# Altium schematic sheet RK-PERIPHERAL-POWER.SchDoc
size 594 x 420 mm; SheetNumber: 17; SheetTotal: 32
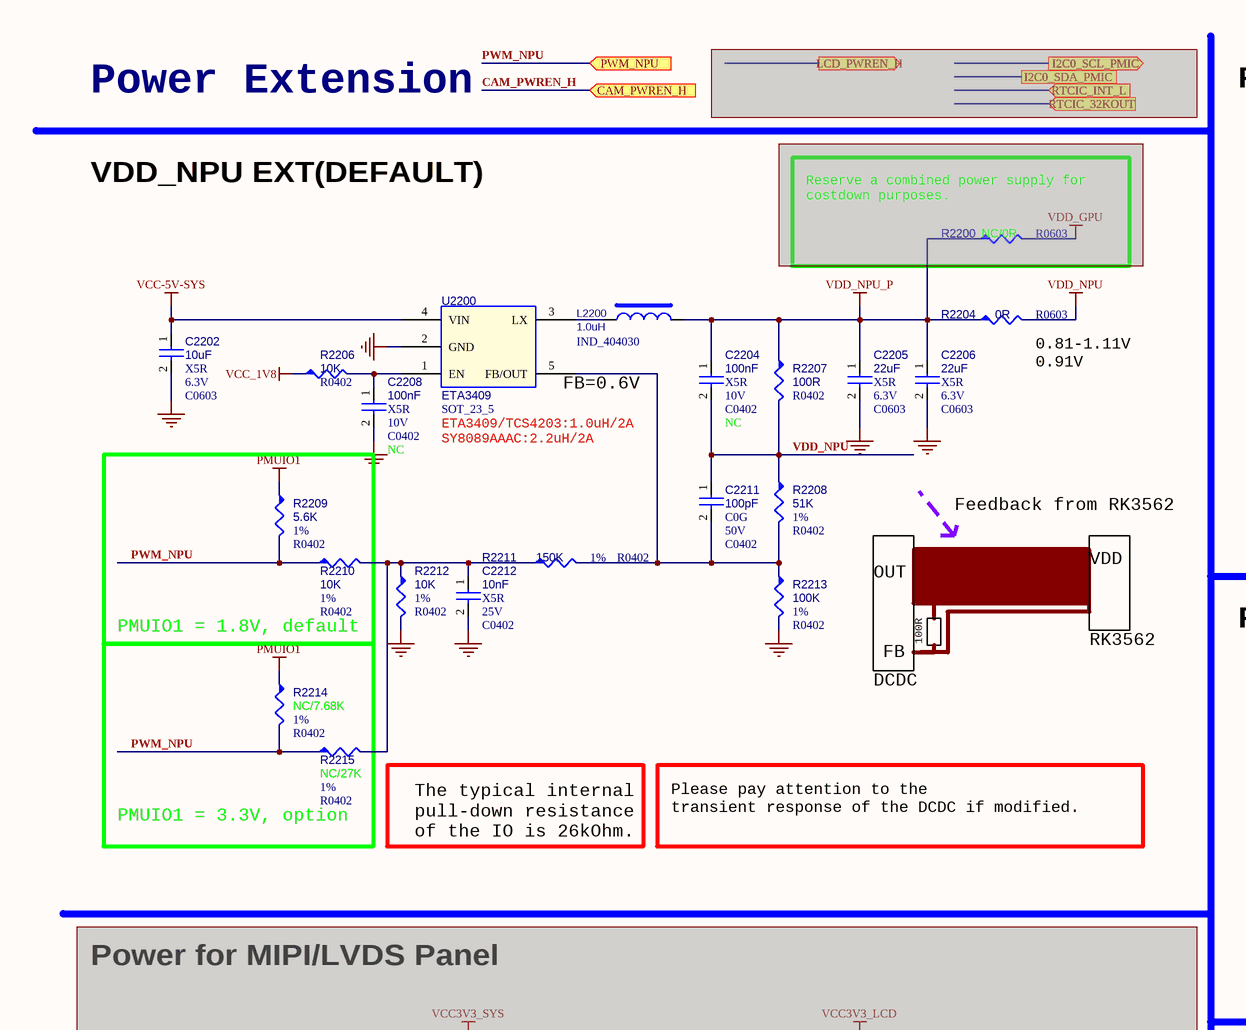
[diagram p0: RK-PERIPHERAL-POWER.SchDoc, top left]
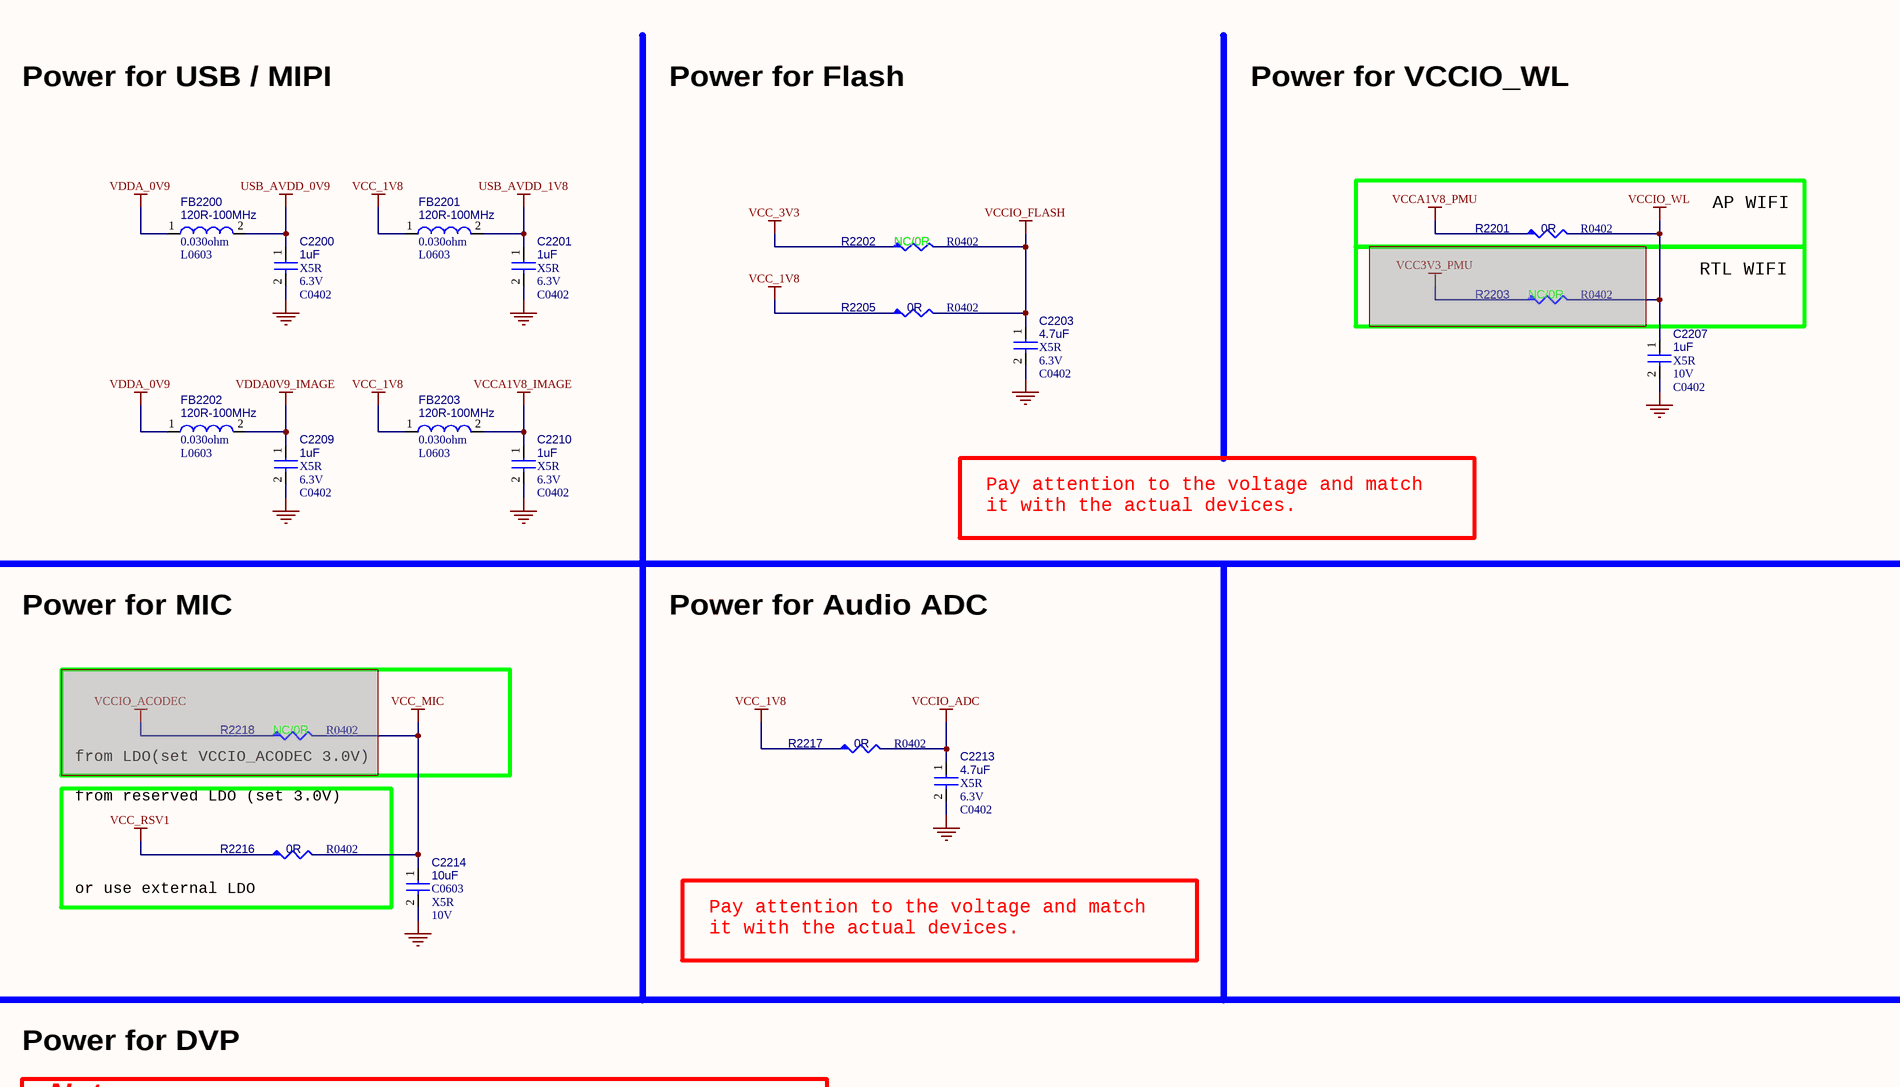
[diagram p1: RK-PERIPHERAL-POWER.SchDoc, top right]
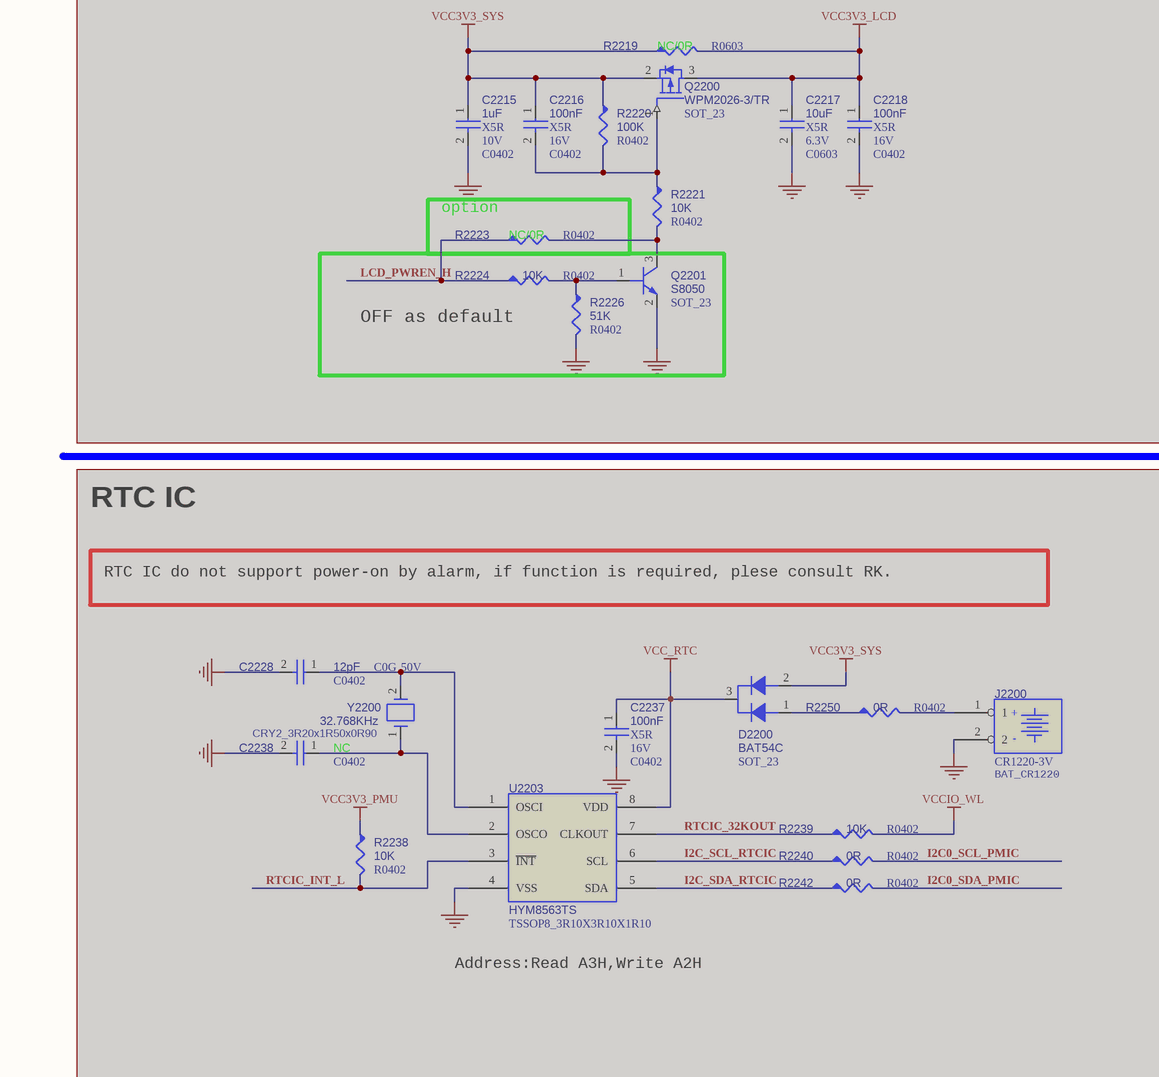
[diagram p2: RK-PERIPHERAL-POWER.SchDoc, bottom left]
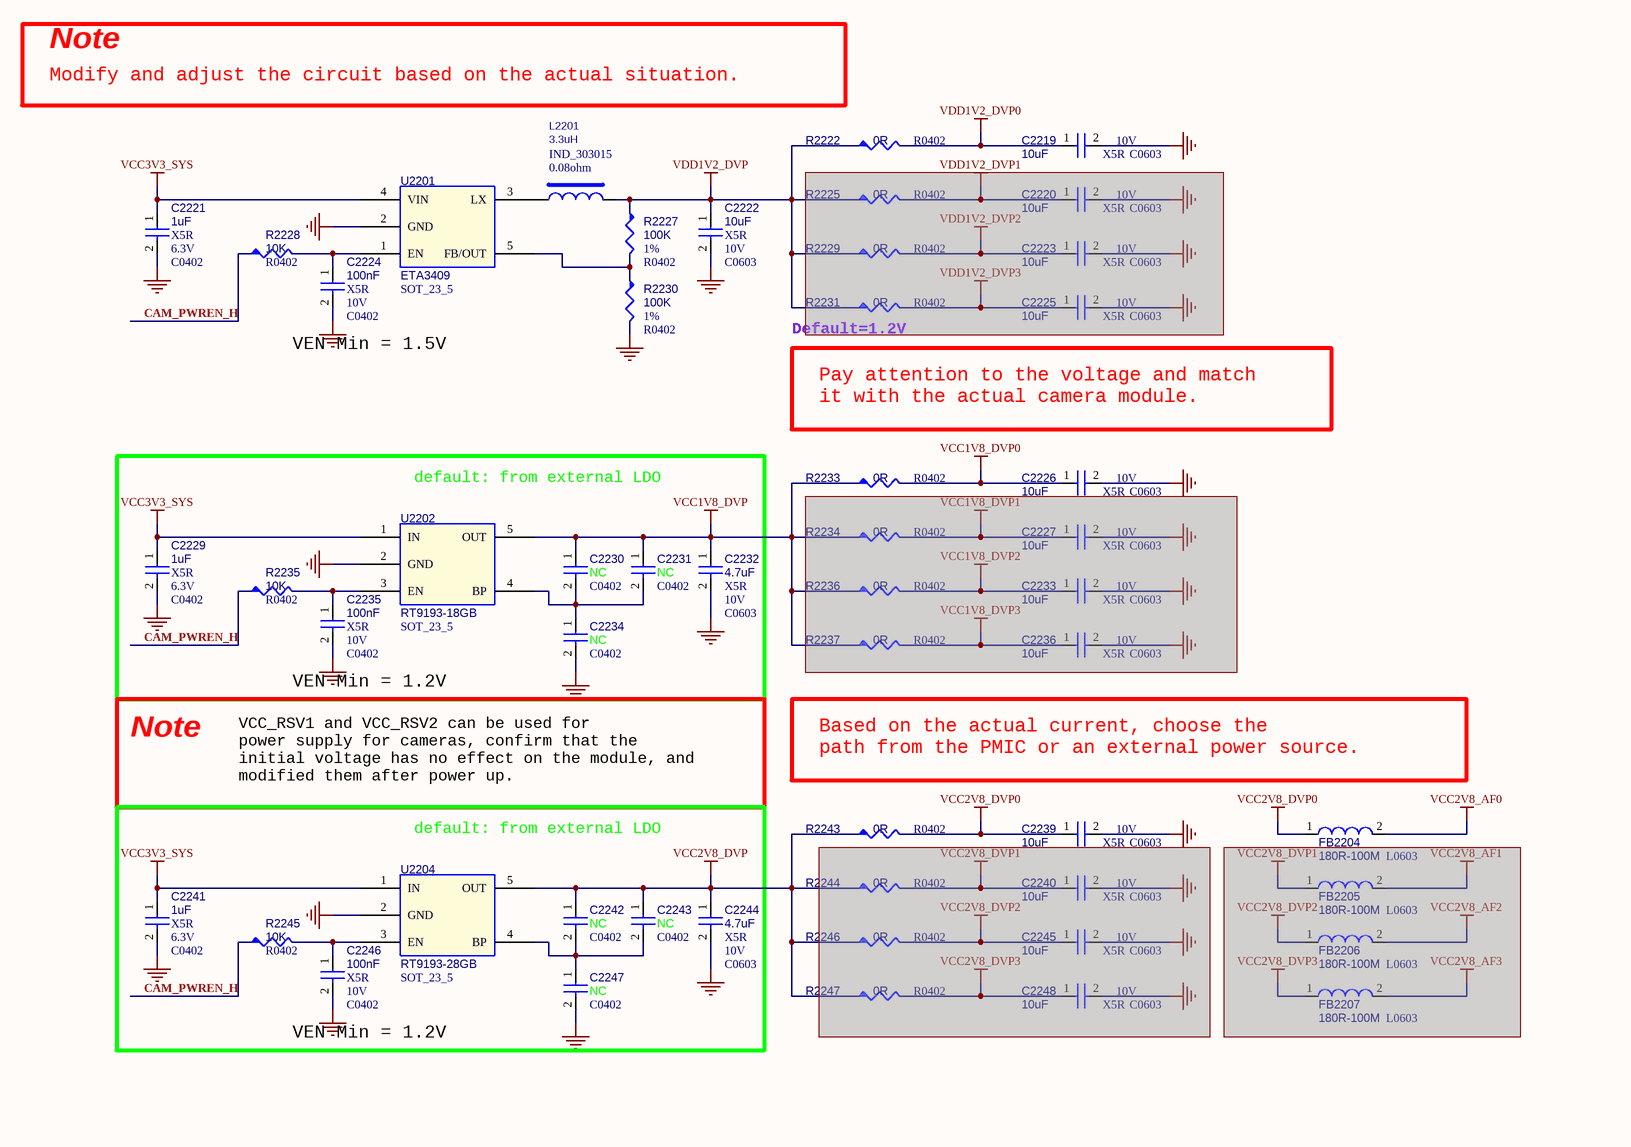
[diagram p3: RK-PERIPHERAL-POWER.SchDoc, bottom right]

## Parts
C2200  1uF  Dielectric: X5R  Voltage: 6.3V  [C0402]
C2201  1uF  Dielectric: X5R  Voltage: 6.3V  [C0402]
C2202  10uF  Dielectric: X5R  Voltage: 6.3V  [C0603]
C2203  4.7uF  Dielectric: X5R  Voltage: 6.3V  [C0402]
C2204  100nF  Dielectric: X5R  Voltage: 10V  option: NC  [C0402]
C2205  22uF  Dielectric: X5R  Voltage: 6.3V  [C0603]
C2206  22uF  Dielectric: X5R  Voltage: 6.3V  [C0603]
C2207  1uF  Dielectric: X5R  Voltage: 10V  [C0402]
C2208  100nF  Dielectric: X5R  Voltage: 10V  option: NC  [C0402]
C2209  1uF  Dielectric: X5R  Voltage: 6.3V  [C0402]
C2210  1uF  Dielectric: X5R  Voltage: 6.3V  [C0402]
C2211  100pF  Dielectric: C0G  Voltage: 50V  [C0402]
C2212  10nF  Dielectric: X5R  Voltage: 25V  [C0402]
C2213  4.7uF  Dielectric: X5R  Voltage: 6.3V  [C0402]
C2214  10uF  Dielectric: X5R  Voltage: 10V  [C0603]
C2215  1uF  Dielectric: X5R  Voltage: 10V  [C0402]  (masked out: inside a compile mask, not in the netlist)
C2216  100nF  Dielectric: X5R  Voltage: 16V  [C0402]  (masked out: inside a compile mask, not in the netlist)
C2217  10uF  Dielectric: X5R  Voltage: 6.3V  [C0603]  (masked out: inside a compile mask, not in the netlist)
C2218  100nF  Dielectric: X5R  Voltage: 16V  [C0402]  (masked out: inside a compile mask, not in the netlist)
C2219  10uF  Dielectric: X5R  Voltage: 10V  [C0603]
C2220  10uF  Dielectric: X5R  Voltage: 10V  [C0603]  (masked out: inside a compile mask, not in the netlist)
C2221  1uF  Dielectric: X5R  Voltage: 6.3V  [C0402]
C2222  10uF  Dielectric: X5R  Voltage: 10V  [C0603]
C2223  10uF  Dielectric: X5R  Voltage: 10V  [C0603]  (masked out: inside a compile mask, not in the netlist)
C2224  100nF  Dielectric: X5R  Voltage: 10V  [C0402]
C2225  10uF  Dielectric: X5R  Voltage: 10V  [C0603]  (masked out: inside a compile mask, not in the netlist)
C2226  10uF  Dielectric: X5R  Voltage: 10V  [C0603]
C2227  10uF  Dielectric: X5R  Voltage: 10V  [C0603]  (masked out: inside a compile mask, not in the netlist)
C2228  12pF  Dielectric: C0G  Voltage: 50V  [C0402]  (masked out: inside a compile mask, not in the netlist)
C2229  1uF  Dielectric: X5R  Voltage: 6.3V  [C0402]
C2230  NC  [C0402]
C2231  NC  [C0402]
C2232  4.7uF  Dielectric: X5R  Voltage: 10V  [C0603]
C2233  10uF  Dielectric: X5R  Voltage: 10V  [C0603]  (masked out: inside a compile mask, not in the netlist)
C2234  NC  [C0402]
C2235  100nF  Dielectric: X5R  Voltage: 10V  [C0402]
C2236  10uF  Dielectric: X5R  Voltage: 10V  [C0603]  (masked out: inside a compile mask, not in the netlist)
C2237  100nF  Dielectric: X5R  Voltage: 16V  [C0402]  (masked out: inside a compile mask, not in the netlist)
C2238  NC  [C0402]  (masked out: inside a compile mask, not in the netlist)
C2239  10uF  Dielectric: X5R  Voltage: 10V  [C0603]
C2240  10uF  Dielectric: X5R  Voltage: 10V  [C0603]  (masked out: inside a compile mask, not in the netlist)
C2241  1uF  Dielectric: X5R  Voltage: 6.3V  [C0402]
C2242  NC  [C0402]
C2243  NC  [C0402]
C2244  4.7uF  Dielectric: X5R  Voltage: 10V  [C0603]
C2245  10uF  Dielectric: X5R  Voltage: 10V  [C0603]  (masked out: inside a compile mask, not in the netlist)
C2246  100nF  Dielectric: X5R  Voltage: 10V  [C0402]
C2247  NC  [C0402]
C2248  10uF  Dielectric: X5R  Voltage: 10V  [C0603]  (masked out: inside a compile mask, not in the netlist)
D2200  BAT54C  [SOT_23]  (masked out: inside a compile mask, not in the netlist)
FB2200  120R-100MHz  DC Resistor: 0.030ohm  [L0603]
FB2201  120R-100MHz  DC Resistor: 0.030ohm  [L0603]
FB2202  120R-100MHz  DC Resistor: 0.030ohm  [L0603]
FB2203  120R-100MHz  DC Resistor: 0.030ohm  [L0603]
FB2204  180R-100M  [L0603]
FB2205  180R-100M  [L0603]  (masked out: inside a compile mask, not in the netlist)
FB2206  180R-100M  [L0603]  (masked out: inside a compile mask, not in the netlist)
FB2207  180R-100M  [L0603]  (masked out: inside a compile mask, not in the netlist)
J2200  CR1220-3V  PCB Footprint: BAT_CR1220  [BATTERY-20MM]  (masked out: inside a compile mask, not in the netlist)
L2200  1.0uH  [IND_404030]
L2201  3.3uH  DC Resistor: 0.08ohm  [IND_303015]
Q2200  WPM2026-3/TR  PCB Footprint: SOT_23  [SOT23]  (masked out: inside a compile mask, not in the netlist)
Q2201  S8050  [SOT_23]  (masked out: inside a compile mask, not in the netlist)
R2200  NC/0R  PCB Footprint: R0603  [R0402]  (masked out: inside a compile mask, not in the netlist)
R2201  0R  [R0402]
R2202  NC/0R  [R0402]
R2203  NC/0R  [R0402]  (masked out: inside a compile mask, not in the netlist)
R2204  0R  PCB Footprint: R0603  [R0402]
R2205  0R  [R0402]
R2206  10K  [R0402]
R2207  100R  [R0402]
R2208  51K  Tolerance: 1%  [R0402]
R2209  5.6K  Tolerance: 1%  [R0402]
R2210  10K  Tolerance: 1%  [R0402]
R2211  150K  Tolerance: 1%  [R0402]
R2212  10K  Tolerance: 1%  [R0402]
R2213  100K  Tolerance: 1%  [R0402]
R2214  NC/7.68K  Tolerance: 1%  [R0402]
R2215  NC/27K  Tolerance: 1%  [R0402]
R2216  0R  [R0402]
R2217  0R  [R0402]
R2218  NC/0R  [R0402]  (masked out: inside a compile mask, not in the netlist)
R2219  NC/0R  PCB Footprint: R0603  [R0402]  (masked out: inside a compile mask, not in the netlist)
R2220  100K  [R0402]  (masked out: inside a compile mask, not in the netlist)
R2221  10K  [R0402]  (masked out: inside a compile mask, not in the netlist)
R2222  0R  [R0402]
R2223  NC/0R  [R0402]  (masked out: inside a compile mask, not in the netlist)
R2224  10K  [R0402]  (masked out: inside a compile mask, not in the netlist)
R2225  0R  [R0402]  (masked out: inside a compile mask, not in the netlist)
R2226  51K  [R0402]  (masked out: inside a compile mask, not in the netlist)
R2227  100K  Tolerance: 1%  [R0402]
R2228  10K  [R0402]
R2229  0R  [R0402]  (masked out: inside a compile mask, not in the netlist)
R2230  100K  Tolerance: 1%  [R0402]
R2231  0R  [R0402]  (masked out: inside a compile mask, not in the netlist)
R2233  0R  [R0402]
R2234  0R  [R0402]  (masked out: inside a compile mask, not in the netlist)
R2235  10K  [R0402]
R2236  0R  [R0402]  (masked out: inside a compile mask, not in the netlist)
R2237  0R  [R0402]  (masked out: inside a compile mask, not in the netlist)
R2238  10K  [R0402]  (masked out: inside a compile mask, not in the netlist)
R2239  10K  [R0402]  (masked out: inside a compile mask, not in the netlist)
R2240  0R  [R0402]  (masked out: inside a compile mask, not in the netlist)
R2242  0R  [R0402]  (masked out: inside a compile mask, not in the netlist)
R2243  0R  [R0402]
R2244  0R  [R0402]  (masked out: inside a compile mask, not in the netlist)
R2245  10K  [R0402]
R2246  0R  [R0402]  (masked out: inside a compile mask, not in the netlist)
R2247  0R  [R0402]  (masked out: inside a compile mask, not in the netlist)
R2250  0R  [R0402]  (masked out: inside a compile mask, not in the netlist)
U2200  ETA3409  [SOT_23_5]
U2201  ETA3409  [SOT_23_5]
U2202  RT9193-18GB  [SOT_23_5]
U2203  HYM8563TS  [TSSOP8_3R10X3R10X1R10]  (masked out: inside a compile mask, not in the netlist)
U2204  RT9193-28GB  [SOT_23_5]
Y2200  32.768KHz  [CRY2_3R20x1R50x0R90]  (masked out: inside a compile mask, not in the netlist)

## Blocks framed on the sheet
AP WIFI: R2201
RTL WIFI: R2203
PMUIO1 = 1.8V, default: R2209 R2210
PMUIO1 = 3.3V, option: R2214 R2215
from LDO(set VCCIO_ACODEC 3.0V): R2218
option: R2223
OFF as default: Q2201 R2224 R2226
VEN Min = 1.2V: C2229-C2232 C2234 C2235 R2235 U2202
VEN Min = 1.2V: C2241-C2244 C2246 C2247 R2245 U2204

## Ports
CAM_PWREN_H (in, see CONTROLLER-RK3562[2D]), I2C0_SCL_PMIC (out), I2C0_SDA_PMIC, LCD_PWREN_H (out), PWM_NPU (in, see CONTROLLER-RK3562[2D], RK3562-PMUIO-OSC-PLL[5C]), RTCIC_32KOUT (in), RTCIC_INT_L (in)

## Nets
GND: C2200.2 C2201.2 C2202.2 C2203.2 C2205.2 C2206.2 C2207.2 C2208.2 C2209.2 C2210.2 C2212.2 C2213.2 C2214.2 C2219.2 C2221.2 C2222.2 C2224.2 C2226.2 C2229.2 C2232.2 C2234.2 C2235.2 C2239.2 C2241.2 C2244.2 C2246.2 C2247.2 R2212.2 R2213.2 R2230.2 U2200.2(GND) U2201.2(GND) U2202.2(GND) U2204.2(GND)
PMUIO1: R2209.1 R2214.1
USB_AVDD_0V9: C2200.1 FB2200.2
USB_AVDD_1V8: C2201.1 FB2201.2
VCC1V8_DVP: C2230.1 C2231.1 C2232.1 R2233.1 U2202.5(OUT)
VCC1V8_DVP0: C2226.1 R2233.2
VCC2V8_AF0: FB2204.2
VCC2V8_DVP: C2242.1 C2243.1 C2244.1 R2243.1 U2204.5(OUT)
VCC2V8_DVP0: C2239.1 FB2204.1 R2243.2
VCC3V3_SYS: C2221.1 C2229.1 C2241.1 U2201.4(VIN) U2202.1(IN) U2204.1(IN)
VCC-5V-SYS: C2202.1 U2200.4(VIN)
VCC_1V8: FB2201.1 FB2203.1 R2205.1 R2206.1 R2217.1
VCC_3V3: R2202.1
VCC_MIC: C2214.1 R2216.2
VCC_RSV1: R2216.1
VCCA1V8_IMAGE: C2210.1 FB2203.2
VCCA1V8_PMU: R2201.1
VCCIO_ADC: C2213.1 R2217.2
VCCIO_FLASH: C2203.1 R2202.2 R2205.2
VCCIO_WL: C2207.1 R2201.2
VDD1V2_DVP: C2222.1 L2201.2 R2222.1 R2227.1
VDD1V2_DVP0: C2219.1 R2222.2
VDD_NPU: C2204.2 C2211.1 R2204.2 R2207.2 R2208.1
VDD_NPU_P: C2204.1 C2205.1 C2206.1 L2200.2 R2204.1 R2207.1
VDDA0V9_IMAGE: C2209.1 FB2202.2
VDDA_0V9: FB2200.1 FB2202.1
CAM_PWREN_H: R2228.1 R2235.1 R2245.1 ; port CAM_PWREN_H
PWM_NPU: R2209.2 R2210.1 R2214.2 R2215.1 ; port PWM_NPU
NetC2208_1: C2208.1 R2206.2 U2200.1(EN)
NetC2211_2: C2211.2 R2208.2 R2211.2 R2213.1 U2200.5(FB/OUT)
NetC2212_1: C2212.1 R2210.2 R2211.1 R2212.1 R2215.2
NetC2224_1: C2224.1 R2228.2 U2201.1(EN)
NetC2230_2: C2230.2 C2231.2 C2234.1 U2202.4(BP)
NetC2235_1: C2235.1 R2235.2 U2202.3(EN)
NetC2242_2: C2242.2 C2243.2 C2247.1 U2204.4(BP)
NetC2246_1: C2246.1 R2245.2 U2204.3(EN)
NetL2200_1: L2200.1 U2200.3(LX)
NetL2201_1: L2201.1 U2201.3(LX)
NetR2227_2: R2227.2 R2230.1 U2201.5(FB/OUT)

## Notes on the sheet
- Power Extension
- Power for USB / MIPI
- Power for Flash
- Power for VCCIO_WL
- VDD_NPU EXT(DEFAULT)
- (near R2200) Reserve a combined power supply for
  costdown purposes.
- (near U2200) FB=0.6V
- (near R2204) 0.81-1.11V
  0.91V
- (near U2200) ETA3409/TCS4203:1.0uH/2A
  SY8089AAAC:2.2uH/2A
- Feedback from RK3562
- Pay attention to the voltage and match
  it with the actual devices.
- OUT
- VDD
- FB
- 100R
- RK3562
- Power for MIC
- Power for Audio ADC
- DCDC
- The typical internal
  pull-down resistance
  of the IO is 26kOhm.
- Please pay attention to the
  transient response of the DCDC if modified.
- from reserved LDO (set 3.0V)
- or use external LDO
- Power for MIPI/LVDS Panel
- Power for DVP
- Note
- Modify and adjust the circuit based on the actual situation.
- (near C2224) VEN Min = 1.5V
- (near R2231) Default=1.2V
- RTC IC
- Pay attention to the voltage and match
  it with the actual camera module.
- RTC IC do not support power-on by alarm, if function is required, plese consult RK.
- default: from external LDO
- VCC_RSV1 and VCC_RSV2 can be used for
  power supply for cameras, confirm that the
  initial voltage has no effect on the module, and
  modified them after power up.
- Based on the actual current, choose the
  path from the PMIC or an external power source.
- Address:Read A3H,Write A2H
- (in symbol CON_BATTERY-20MM) +; -

## Library data of the parts
C2200 = CAP NP: cap,1.00uF,+/-10%,6.3V,X5R,C0402; Part Reference: C2200; Manufacturer PN: C1005X5R0J105K050BB; Manufacturer: TDK; Tolerance: 10%; Priority: A; PCB Footprint: C0402; Value: 1uF; Created by: JJJ; Part Type: C0402; RK PN: C1005X5R0J105K050BB
C2201 = CAP NP: cap,1.00uF,+/-10%,6.3V,X5R,C0402; Part Reference: C2201; Manufacturer: TDK; RK PN: C1005X5R0J105K050BB; Priority: A; Tolerance: 10%; PCB Footprint: C0402; Value: 1uF; Part Type: C0402; Manufacturer PN: C1005X5R0J105K050BB; Created by: JJJ
C2202 = CAP NP: cap,10.00uF,+/-10%,6.3V,X5R,C0603; Part Reference: C2202; Manufacturer PN: C1608X5R0J106K080AB; Manufacturer: TDK; Tolerance: 10%; Priority: A; PCB Footprint: C0603; Value: 10uF; Created by: JJJ; Part Type: C0603; RK PN: C1608X5R0J106K080AB
C2203 = CAP NP: cap,4.70uF,+/-10%,6.3V,X5R,C0402; Part Reference: C2203; Manufacturer: TDK; RK PN: C1005X5R0J475K050BC; Priority: A; Tolerance: 10%; PCB Footprint: C0402; Value: 4.7uF; Part Type: C0402; Manufacturer PN: C1005X5R0J475K050BC; Created by: JJJ
C2204 = CAP NP: cap,100.00nF,+/-10%,10V,X5R,C0402; Part Reference: C2204; Manufacturer: TDK; RK PN: C1005X5R1A104K050BA; Priority: A; Tolerance: 10%; PCB Footprint: C0402; Value: 100nF; Part Type: C0402; Manufacturer PN: C1005X5R1A104K050BA; Created by: JJJ
C2205 = CAP NP: cap,22.00uF,+/-20%,6.3V,X5R,C0603; Part Reference: C2205; Manufacturer: TDK; RK PN: C1608X5R0J226M080AC; Priority: A; Tolerance: 20%; PCB Footprint: C0603; Value: 22uF; Part Type: C0603; C_Voltage: 6.3V; Manufacturer PN: C1608X5R0J226M080AC; Created by: JJJ
C2206 = CAP NP: cap,22.00uF,+/-20%,6.3V,X5R,C0603; Part Reference: C2206; Manufacturer PN: C1608X5R0J226M080AC; Manufacturer: TDK; Tolerance: 20%; Priority: A; Number: 37; PCB Footprint: C0603; Value: 22uF; Created by: JJJ; C_Voltage: 6.3V; Part Type: C0603; RK PN: C1608X5R0J226M080AC
C2207 = CAP NP: cap,1.00uF,+/-10%,10V,X5R,C0402; Part Reference: C2207; Manufacturer: TDK; RK PN: C1005X5R1A105K050BB; Priority: A; Tolerance: 10%; PCB Footprint: C0402; Value: 1uF; Part Type: C0402; Manufacturer PN: C1005X5R1A105K050BB; Created by: JJJ
C2208 = CAP NP: cap,100.00nF,+/-10%,10V,X5R,C0402; Part Reference: C2208; Manufacturer PN: C1005X5R1A104K050BA; Manufacturer: TDK; Tolerance: 10%; Priority: A; PCB Footprint: C0402; Value: 100nF; Created by: JJJ; Part Type: C0402; RK PN: C1005X5R1A104K050BA
C2209 = CAP NP: cap,1.00uF,+/-10%,6.3V,X5R,C0402; Part Reference: C2209; Manufacturer: TDK; RK PN: C1005X5R0J105K050BB; Priority: A; Tolerance: 10%; PCB Footprint: C0402; Value: 1uF; Part Type: C0402; Manufacturer PN: C1005X5R0J105K050BB; Created by: JJJ
C2210 = CAP NP: cap,1.00uF,+/-10%,6.3V,X5R,C0402; Part Reference: C2210; Manufacturer PN: C1005X5R0J105K050BB; Manufacturer: TDK; Tolerance: 10%; Priority: A; PCB Footprint: C0402; Value: 1uF; Created by: JJJ; Part Type: C0402; RK PN: C1005X5R0J105K050BB
C2211 = CAP NP: cap,100.00pF,+/-10%,50V,C0G,C0402; Part Reference: C2211; Manufacturer: TDK; RK PN: C1005C0G1H101K050BA; Priority: A; Tolerance: 10%; PCB Footprint: C0402; Value: 100pF; Part Type: C0402; Manufacturer PN: C1005C0G1H101K050BA; Created by: JJJ
C2212 = CAP NP: cap,10.00nF,+/-10%,25V,X5R,C0402; Part Reference: C2212; Manufacturer: TDK; RK PN: C1005X5R1E103K050BA; Priority: A; Tolerance: 10%; PCB Footprint: C0402; Value: 10nF; Part Type: C0402; Manufacturer PN: C1005X5R1E103K050BA; Created by: JJJ
C2213 = CAP NP: cap,4.70uF,+/-10%,6.3V,X5R,C0402; Part Reference: C2213; Manufacturer PN: C1005X5R0J475K050BC; Manufacturer: TDK; Tolerance: 10%; Priority: A; PCB Footprint: C0402; Value: 4.7uF; Created by: JJJ; Part Type: C0402; RK PN: C1005X5R0J475K050BC
C2214 = CAP NP: 一般用片状陶瓷电容(GRM),cap,10uF,±10%,10V,X5R,C0603; Part Reference: C2214; Manufacturer: murata; Manufacturer PN: GRM188R61A106KAAL; RK PN: 902006688; Priority: A; PCB Footprint: C0603; Value: 10uF; Part Type: 一般用片状陶瓷电容; Tolerance: ±10%; Created by: JJJ
C2215 = CAP NP: cap,1.00uF,+/-10%,10V,X5R,C0402; Part Reference: C2215; Manufacturer: TDK; RK PN: C1005X5R1A105K050BB; Priority: A; Tolerance: 10%; PCB Footprint: C0402; Value: 1uF; Part Type: C0402; Manufacturer PN: C1005X5R1A105K050BB; Created by: JJJ
C2216 = CAP NP: cap,100.00nF,+/-10%,16V,X5R,C0402; Part Reference: C2216; Manufacturer PN: C1005X5R1C104K050BA; Manufacturer: TDK; Tolerance: 10%; Priority: A; PCB Footprint: C0402; Value: 100nF; Created by: JJJ; Part Type: C0402; RK PN: C1005X5R1C104K050BA
C2217 = CAP NP: cap,10.00uF,+/-10%,6.3V,X5R,C0603; Part Reference: C2217; Manufacturer PN: C1608X5R0J106K080AB; Manufacturer: TDK; Tolerance: 10%; Priority: A; PCB Footprint: C0603; Value: 10uF; Created by: JJJ; Part Type: C0603; RK PN: C1608X5R0J106K080AB
C2218 = CAP NP: cap,100.00nF,+/-10%,16V,X5R,C0402; Part Reference: C2218; Manufacturer: TDK; RK PN: C1005X5R1C104K050BA; Priority: A; Tolerance: 10%; PCB Footprint: C0402; Value: 100nF; Part Type: C0402; Manufacturer PN: C1005X5R1C104K050BA; Created by: JJJ
C2219 = CAP NP: cap,10.00uF,+/-10%,10V,X5R,C0603; Part Reference: C2219; Manufacturer: TDK; RK PN: C1608X5R1A106K080AC; Priority: A; Tolerance: 10%; PCB Footprint: C0603; Value: 10uF; Part Type: C0603; Manufacturer PN: C1608X5R1A106K080AC; Created by: JJJ
C2220 = CAP NP: cap,10.00uF,+/-10%,10V,X5R,C0603; Part Reference: C2220; Manufacturer: TDK; RK PN: C1608X5R1A106K080AC; Priority: A; Tolerance: 10%; PCB Footprint: C0603; Value: 10uF; Part Type: C0603; Manufacturer PN: C1608X5R1A106K080AC; Created by: JJJ
C2221 = CAP NP: cap,1.00uF,+/-10%,6.3V,X5R,C0402; Part Reference: C2221; Manufacturer: TDK; RK PN: C1005X5R0J105K050BB; Priority: A; Tolerance: 10%; PCB Footprint: C0402; Value: 1uF; Part Type: C0402; Manufacturer PN: C1005X5R0J105K050BB; Created by: JJJ
C2222 = CAP NP: cap,10.00uF,+/-10%,10V,X5R,C0603; Part Reference: C2222; Manufacturer: TDK; RK PN: C1608X5R1A106K080AC; Priority: A; Tolerance: 10%; PCB Footprint: C0603; Value: 10uF; Part Type: C0603; Manufacturer PN: C1608X5R1A106K080AC; Created by: JJJ
C2223 = CAP NP: cap,10.00uF,+/-10%,10V,X5R,C0603; Part Reference: C2223; Manufacturer: TDK; RK PN: C1608X5R1A106K080AC; Priority: A; Tolerance: 10%; PCB Footprint: C0603; Value: 10uF; Part Type: C0603; Manufacturer PN: C1608X5R1A106K080AC; Created by: JJJ
C2224 = CAP NP: cap,100.00nF,+/-10%,10V,X5R,C0402; Part Reference: C2224; Manufacturer: TDK; RK PN: C1005X5R1A104K050BA; Priority: A; Tolerance: 10%; PCB Footprint: C0402; Value: 100nF; Part Type: C0402; Manufacturer PN: C1005X5R1A104K050BA; Created by: JJJ
C2225 = CAP NP: cap,10.00uF,+/-10%,10V,X5R,C0603; Part Reference: C2225; Manufacturer: TDK; RK PN: C1608X5R1A106K080AC; Priority: A; Tolerance: 10%; PCB Footprint: C0603; Value: 10uF; Part Type: C0603; Manufacturer PN: C1608X5R1A106K080AC; Created by: JJJ
C2226 = CAP NP: cap,10.00uF,+/-10%,10V,X5R,C0603; Part Reference: C2226; Manufacturer: TDK; RK PN: C1608X5R1A106K080AC; Priority: A; Tolerance: 10%; PCB Footprint: C0603; Value: 10uF; Part Type: C0603; Manufacturer PN: C1608X5R1A106K080AC; Created by: JJJ
C2227 = CAP NP: cap,10.00uF,+/-10%,10V,X5R,C0603; Part Reference: C2227; Manufacturer: TDK; RK PN: C1608X5R1A106K080AC; Priority: A; Tolerance: 10%; PCB Footprint: C0603; Value: 10uF; Part Type: C0603; Manufacturer PN: C1608X5R1A106K080AC; Created by: JJJ
C2228 = CAP NP: cap,12.00pF,+/-5%,50V,C0G,C0402; Part Reference: C2228; Manufacturer: TDK; RK PN: C1005C0G1H120J050BA; Priority: A; Tolerance: 5%; PCB Footprint: C0402; Value: 12pF; Part Type: C0402; Manufacturer PN: C1005C0G1H120J050BA; Created by: JJJ
C2229 = CAP NP: cap,1.00uF,+/-10%,6.3V,X5R,C0402; Part Reference: C2229; Manufacturer PN: C1005X5R0J105K050BB; Manufacturer: TDK; Tolerance: 10%; Priority: A; PCB Footprint: C0402; Value: 1uF; Created by: JJJ; Part Type: C0402; RK PN: C1005X5R0J105K050BB
C2230 = CAP NP: Did Not Place.; Part Reference: C2230; Manufacturer PN: DNPC0402; Priority: A; PCB Footprint: C0402; Value: NC; Created by: JJJ; Part Type: DNP; RK PN: DNPC0402
C2231 = CAP NP: Did Not Place.; Part Reference: C2231; RK PN: DNPC0402; Priority: A; PCB Footprint: C0402; Value: NC; Part Type: DNP; Manufacturer PN: DNPC0402; Created by: JJJ
C2232 = CAP NP: cap,4.70uF,+/-10%,10V,X5R,C0603; Part Reference: C2232; Manufacturer: TDK; RK PN: C1608X5R1A475K080AC; Priority: A; Tolerance: 10%; PCB Footprint: C0603; Value: 4.7uF; Part Type: C0603; Manufacturer PN: C1608X5R1A475K080AC; Created by: JJJ
C2233 = CAP NP: cap,10.00uF,+/-10%,10V,X5R,C0603; Part Reference: C2233; Manufacturer: TDK; RK PN: C1608X5R1A106K080AC; Priority: A; Tolerance: 10%; PCB Footprint: C0603; Value: 10uF; Part Type: C0603; Manufacturer PN: C1608X5R1A106K080AC; Created by: JJJ
C2234 = CAP NP: Did Not Place.; Part Reference: C2234; RK PN: DNPC0402; Priority: A; PCB Footprint: C0402; Value: NC; Part Type: DNP; Manufacturer PN: DNPC0402; Created by: JJJ
C2235 = CAP NP: cap,100.00nF,+/-10%,10V,X5R,C0402; Part Reference: C2235; Manufacturer PN: C1005X5R1A104K050BA; Manufacturer: TDK; Tolerance: 10%; Priority: A; PCB Footprint: C0402; Value: 100nF; Created by: JJJ; Part Type: C0402; RK PN: C1005X5R1A104K050BA
C2236 = CAP NP: cap,10.00uF,+/-10%,10V,X5R,C0603; Part Reference: C2236; Manufacturer: TDK; RK PN: C1608X5R1A106K080AC; Priority: A; Tolerance: 10%; PCB Footprint: C0603; Value: 10uF; Part Type: C0603; Manufacturer PN: C1608X5R1A106K080AC; Created by: JJJ
C2237 = CAP NP: cap,100.00nF,+/-10%,16V,X5R,C0402; Part Reference: C2237; Manufacturer PN: C1005X5R1C104K050BA; Manufacturer: TDK; Tolerance: 10%; Priority: A; PCB Footprint: C0402; Value: 100nF; Created by: JJJ; Part Type: C0402; RK PN: C1005X5R1C104K050BA
C2238 = CAP NP: Did Not Place.; Part Reference: C2238; RK PN: DNPC0402; Priority: A; PCB Footprint: C0402; Value: NC; Part Type: DNP; Manufacturer PN: DNPC0402; Created by: JJJ
C2239 = CAP NP: cap,10.00uF,+/-10%,10V,X5R,C0603; Part Reference: C2239; Manufacturer: TDK; RK PN: C1608X5R1A106K080AC; Priority: A; Tolerance: 10%; PCB Footprint: C0603; Value: 10uF; Part Type: C0603; Manufacturer PN: C1608X5R1A106K080AC; Created by: JJJ
C2240 = CAP NP: cap,10.00uF,+/-10%,10V,X5R,C0603; Part Reference: C2240; Manufacturer: TDK; RK PN: C1608X5R1A106K080AC; Priority: A; Tolerance: 10%; PCB Footprint: C0603; Value: 10uF; Part Type: C0603; Manufacturer PN: C1608X5R1A106K080AC; Created by: JJJ
C2241 = CAP NP: cap,1.00uF,+/-10%,6.3V,X5R,C0402; Part Reference: C2241; Manufacturer PN: C1005X5R0J105K050BB; Manufacturer: TDK; Tolerance: 10%; Priority: A; PCB Footprint: C0402; Value: 1uF; Created by: JJJ; Part Type: C0402; RK PN: C1005X5R0J105K050BB
C2242 = CAP NP: Did Not Place.; Part Reference: C2242; Manufacturer PN: DNPC0402; Priority: A; PCB Footprint: C0402; Value: NC; Created by: JJJ; Part Type: DNP; RK PN: DNPC0402
C2243 = CAP NP: Did Not Place.; Part Reference: C2243; RK PN: DNPC0402; Priority: A; PCB Footprint: C0402; Value: NC; Part Type: DNP; Manufacturer PN: DNPC0402; Created by: JJJ
C2244 = CAP NP: cap,4.70uF,+/-10%,10V,X5R,C0603; Part Reference: C2244; Manufacturer: TDK; RK PN: C1608X5R1A475K080AC; Priority: A; Tolerance: 10%; PCB Footprint: C0603; Value: 4.7uF; Part Type: C0603; Manufacturer PN: C1608X5R1A475K080AC; Created by: JJJ
C2245 = CAP NP: cap,10.00uF,+/-10%,10V,X5R,C0603; Part Reference: C2245; Manufacturer: TDK; RK PN: C1608X5R1A106K080AC; Priority: A; Tolerance: 10%; PCB Footprint: C0603; Value: 10uF; Part Type: C0603; Manufacturer PN: C1608X5R1A106K080AC; Created by: JJJ
C2246 = CAP NP: cap,100.00nF,+/-10%,10V,X5R,C0402; Part Reference: C2246; Manufacturer PN: C1005X5R1A104K050BA; Manufacturer: TDK; Tolerance: 10%; Priority: A; PCB Footprint: C0402; Value: 100nF; Created by: JJJ; Part Type: C0402; RK PN: C1005X5R1A104K050BA
C2247 = CAP NP: Did Not Place.; Part Reference: C2247; RK PN: DNPC0402; Priority: A; PCB Footprint: C0402; Value: NC; Part Type: DNP; Manufacturer PN: DNPC0402; Created by: JJJ
C2248 = CAP NP: cap,10.00uF,+/-10%,10V,X5R,C0603; Part Reference: C2248; Manufacturer: TDK; RK PN: C1608X5R1A106K080AC; Priority: A; Tolerance: 10%; PCB Footprint: C0603; Value: 10uF; Part Type: C0603; Manufacturer PN: C1608X5R1A106K080AC; Created by: JJJ
D2200 = DIODE Double: Dual Schottky barrier，BAT54C SOT-23 Schottky Barrier; Part Reference: D2200; Manufacturer: 长电; Priority: A; PCB Footprint: SOT_23; Value: BAT54C; RK PN: BAT54C; Part Type: Schottky rectifier; Manufacturer PN: BAT54C; Created by: JJJ
FB2200 = BEAD: BEAD,120R@100MHz,current=2000mA,0603; Part Reference: FB2200; Manufacturer: Murata; Tolerance: 25%; Irms: 2A; RK PN: BLM18KG121TN1; Priority: L; PCB Footprint: L0603; Value: 120R-100MHz; Part Type: BEAD; Manufacturer PN: BLM18KG121TN1; Created by: DZS
FB2201 = BEAD: BEAD,120R@100MHz,current=2000mA,0603; Part Reference: FB2201; Manufacturer PN: BLM18KG121TN1; Manufacturer: Murata; Tolerance: 25%; Irms: 2A; Priority: L; PCB Footprint: L0603; Value: 120R-100MHz; Created by: DZS; Part Type: BEAD; RK PN: BLM18KG121TN1
FB2202 = BEAD: BEAD,120R@100MHz,current=2000mA,0603; Part Reference: FB2202; Manufacturer PN: BLM18KG121TN1; Manufacturer: Murata; Tolerance: 25%; Irms: 2A; Priority: L; PCB Footprint: L0603; Value: 120R-100MHz; Created by: DZS; Part Type: BEAD; RK PN: BLM18KG121TN1
FB2203 = BEAD: BEAD,120R@100MHz,current=2000mA,0603; Part Reference: FB2203; Manufacturer: Murata; Tolerance: 25%; Irms: 2A; RK PN: BLM18KG121TN1; Priority: L; PCB Footprint: L0603; Value: 120R-100MHz; Part Type: BEAD; Manufacturer PN: BLM18KG121TN1; Created by: DZS
FB2204 = BEAD: Ferrite Bead,180R-100M,0.25,L0603; Part Reference: FB2204; Manufacturer PN: BLM18PG181SN1; Manufacturer: Murata; DC Resistor: 0.09ohm; Tolerance: 25%; Irms: 1.5A; Priority: A; PCB Footprint: L0603; Value: 180R-100M; Created by: YTL; Part Type: BEAD; RK PN: BLM18PG181SN1
FB2205 = BEAD: Ferrite Bead,180R-100M,0.25,L0603; Part Reference: FB2205; Manufacturer PN: BLM18PG181SN1; Manufacturer: Murata; DC Resistor: 0.09ohm; Tolerance: 25%; Irms: 1.5A; Priority: A; PCB Footprint: L0603; Value: 180R-100M; Created by: YTL; Part Type: BEAD; RK PN: BLM18PG181SN1
FB2206 = BEAD: Ferrite Bead,180R-100M,0.25,L0603; Part Reference: FB2206; Manufacturer PN: BLM18PG181SN1; Manufacturer: Murata; DC Resistor: 0.09ohm; Tolerance: 25%; Irms: 1.5A; Priority: A; PCB Footprint: L0603; Value: 180R-100M; Created by: YTL; Part Type: BEAD; RK PN: BLM18PG181SN1
FB2207 = BEAD: Ferrite Bead,180R-100M,0.25,L0603; Part Reference: FB2207; Manufacturer PN: BLM18PG181SN1; Manufacturer: Murata; DC Resistor: 0.09ohm; Tolerance: 25%; Irms: 1.5A; Priority: A; PCB Footprint: L0603; Value: 180R-100M; Created by: YTL; Part Type: BEAD; RK PN: BLM18PG181SN1
J2200 = CON_BATTERY-20MM: Part Reference: J2200; Value: CR1220-3V
L2200 = INDUCTORS OF FERRITE: Power Inductor,1.0uH,0.3,IND_404030; Part Reference: L2200; Manufacturer PN: SWPA4030S1R0NT; Manufacturer: sunlord; Isat: 5.26A; DC Resistor: 0.014ohm; Resonace frequency: 70M; Irms: 4.15A; Tolerance: 30%; Priority: A; PCB Footprint: IND_404030; Value: 1.0uH; Created by: YTL; Part Type: POWER_IND; RK PN: SWPA4030S1R0NT
L2201 = INDUCTORS OF FERRITE: Power Inductor,3.3uH,0.2,IND_303015; Part Reference: L2201; Manufacturer PN: SWPA3015S3R3MT; Manufacturer: sunlord; Isat: 1.32A; Resonace frequency: 68M; Irms: 1.36A; Tolerance: 20%; Priority: A; PCB Footprint: IND_303015; Value: 3.3uH; Created by: YTL; Part Type: POWER_IND; RK PN: SWPA3015S3R3MT
Q2200 = MOSFET P: PMOS,WPM2026-3/TR,SOT_23,Id=3.2A,Vds=20V; Part Reference: Q2200; Manufacturer: WillSemi(韦尔半导体); Priority: A; Id_max: 3.2A; Vgs: ±12V; VDS: 20V; Vgsth: 0.6V; Pd: 0.6W; Value: WPM2026-3/TR; RK PN: WPM2026-3/TR; Part Type: PMOS; Manufacturer PN: WPM2026-3/TR; Created by: JJJ
Q2201 = NPN: S8050,SOT23; Part Reference: Q2201; Manufacturer: 长电; Manufacturer PN: S8050_SOT23; Priority: A; Ic: 0.5A; Vceo: 25V; Pc: 0.3W; PCB Footprint: SOT_23; Value: S8050; RK PN: S8050; Part Type: NPN; Created by: JJJ
R2200 = RESISTOR5_NC: 通用厚膜电阻,0R,+/-5%,R0603,1/10W.; Part Reference: R2200; Manufacturer: YAGEO; Manufacturer PN: RC0603JR-070RL; Tolerance: 5%; RK PN: 901002435-1; Priority: A; Wattage: 1/10W; Optional: X; Value: NC/0R; Part Type: 通用厚膜电阻; Created by: YTL
R2201 = RESISTOR5: 通用厚膜电阻,0R,+/-5%,R0402,1/16W.; Part Reference: R2201; Manufacturer: YAGEO; Manufacturer PN: RC0402JR-070RL; Tolerance: 5%; RK PN: 901001446; Priority: A; Wattage: 1/16W; PCB Footprint: R0402; Value: 0R; Part Type: 通用厚膜电阻; Created by: YTL
R2202 = RESISTOR5_NC: 通用厚膜电阻,0R,+/-5%,R0402,1/16W.; Part Reference: R2202; Manufacturer PN: RC0402JR-070RL; Manufacturer: YAGEO; Tolerance: 5%; Optional: X; Wattage: 1/16W; Priority: A; RK PN: 901001446-1; PCB Footprint: R0402; Value: NC/0R; Created by: YTL; Part Type: 通用厚膜电阻
R2203 = RESISTOR5_NC: 通用厚膜电阻,0R,+/-5%,R0402,1/16W.; Part Reference: R2203; Manufacturer PN: RC0402JR-070RL; Manufacturer: YAGEO; Tolerance: 5%; Optional: X; Wattage: 1/16W; Priority: A; RK PN: 901001446-1; PCB Footprint: R0402; Value: NC/0R; Created by: YTL; Part Type: 通用厚膜电阻
R2204 = RESISTOR5: 通用厚膜电阻,0R,+/-5%,R0603,1/10W.; Part Reference: R2204; Manufacturer PN: RC0603JR-070RL; Manufacturer: YAGEO; Tolerance: 5%; Wattage: 1/10W; Priority: A; RK PN: 901002435; Value: 0R; Created by: YTL; Part Type: 通用厚膜电阻
R2205 = RESISTOR5: 通用厚膜电阻,0R,+/-5%,R0402,1/16W.; Part Reference: R2205; Manufacturer PN: RC0402JR-070RL; Manufacturer: YAGEO; Tolerance: 5%; Wattage: 1/16W; Priority: A; RK PN: 901001446; PCB Footprint: R0402; Value: 0R; Created by: YTL; Part Type: 通用厚膜电阻
R2206 = RESISTOR5: 通用厚膜电阻,10K,+/-5%,R0402,1/16W.; Part Reference: R2206; Manufacturer PN: RC0402JR-0710KL; Manufacturer: YAGEO; Tolerance: 5%; Wattage: 1/16W; Priority: A; RK PN: 901001449; PCB Footprint: R0402; Value: 10K; Created by: YTL; Part Type: 通用厚膜电阻
R2207 = RESISTOR5: 通用厚膜电阻,100R,+/-5%,R0402,1/16W.; Part Reference: R2207; Manufacturer PN: RC0402JR-07100RL; Manufacturer: YAGEO; Tolerance: 5%; Wattage: 1/16W; Priority: A; RK PN: 901001448; PCB Footprint: R0402; Value: 100R; Created by: YTL; Part Type: 通用厚膜电阻
R2208 = RESISTOR1: 通用厚膜电阻,51K,+/-1%,R0402,1/16W.; Part Reference: R2208; Manufacturer PN: RC0402FR-0751KL; Manufacturer: YAGEO; Wattage: 1/16W; Priority: A; RK PN: 901001253; PCB Footprint: R0402; Value: 51K; Created by: YTL; Part Type: 通用厚膜电阻
R2209 = RESISTOR1: 通用厚膜电阻,5K6,+/-1%,R0402,1/16W.; Part Reference: R2209; Manufacturer PN: RC0402FR-075K6L; Manufacturer: YAGEO; Wattage: 1/16W; Priority: A; RK PN: 901001290; PCB Footprint: R0402; Value: 5.6K; Created by: YTL; Part Type: 通用厚膜电阻
R2210 = RESISTOR1: 通用厚膜电阻,10K,+/-1%,R0402,1/16W.; Part Reference: R2210; Manufacturer PN: RC0402FR-0710KL; Manufacturer: YAGEO; Wattage: 1/16W; Priority: A; RK PN: 901000777; PCB Footprint: R0402; Value: 10K; Created by: YTL; Part Type: 通用厚膜电阻
R2211 = RESISTOR1: 通用厚膜电阻,150K,+/-1%,R0402,1/16W.; Part Reference: R2211; Manufacturer PN: RC0402FR-07150KL; Manufacturer: YAGEO; Wattage: 1/16W; Priority: A; RK PN: 901000837; PCB Footprint: R0402; Value: 150K; Created by: YTL; Part Type: 通用厚膜电阻
R2212 = RESISTOR1: 通用厚膜电阻,10K,+/-1%,R0402,1/16W.; Part Reference: R2212; Manufacturer: YAGEO; Manufacturer PN: RC0402FR-0710KL; RK PN: 901000777; Priority: A; Wattage: 1/16W; PCB Footprint: R0402; Value: 10K; Part Type: 通用厚膜电阻; Created by: YTL
R2213 = RESISTOR1: 通用厚膜电阻,100K,+/-1%,R0402,1/16W.; Part Reference: R2213; Manufacturer PN: RC0402FR-07100KL; Manufacturer: YAGEO; Wattage: 1/16W; Priority: A; RK PN: 901000766; PCB Footprint: R0402; Value: 100K; Created by: YTL; Part Type: 通用厚膜电阻
R2214 = RESISTOR1_NC: 通用厚膜电阻,7K68,+/-1%,R0402,1/16W.; Part Reference: R2214; Manufacturer PN: RC0402FR-077K68L; Manufacturer: YAGEO; Optional: X; Wattage: 1/16W; Priority: A; RK PN: 901001379-1; PCB Footprint: R0402; Value: NC/7.68K; Created by: YTL; Part Type: 通用厚膜电阻
R2215 = RESISTOR1_NC: 通用厚膜电阻,27K,+/-1%,R0402,1/16W.; Part Reference: R2215; Manufacturer: YAGEO; Manufacturer PN: RC0402FR-0727KL; RK PN: 901001021-1; Priority: A; Wattage: 1/16W; Optional: X; PCB Footprint: R0402; Value: NC/27K; Part Type: 通用厚膜电阻; Created by: YTL
R2216 = RESISTOR5: 通用厚膜电阻,0R,+/-5%,R0402,1/16W.; Part Reference: R2216; Manufacturer PN: RC0402JR-070RL; Manufacturer: YAGEO; Tolerance: 5%; Wattage: 1/16W; Priority: A; RK PN: 901001446; PCB Footprint: R0402; Value: 0R; Created by: YTL; Part Type: 通用厚膜电阻
R2217 = RESISTOR5: 通用厚膜电阻,0R,+/-5%,R0402,1/16W.; Part Reference: R2217; Manufacturer: YAGEO; Manufacturer PN: RC0402JR-070RL; Tolerance: 5%; RK PN: 901001446; Priority: A; Wattage: 1/16W; PCB Footprint: R0402; Value: 0R; Part Type: 通用厚膜电阻; Created by: YTL
R2218 = RESISTOR5_NC: 通用厚膜电阻,0R,+/-5%,R0402,1/16W.; Part Reference: R2218; Manufacturer PN: RC0402JR-070RL; Manufacturer: YAGEO; Tolerance: 5%; Optional: X; Wattage: 1/16W; Priority: A; RK PN: 901001446-1; PCB Footprint: R0402; Value: NC/0R; Created by: YTL; Part Type: 通用厚膜电阻
R2219 = RESISTOR5_NC: 通用厚膜电阻,0R,+/-5%,R0603,1/10W.; Part Reference: R2219; Manufacturer: YAGEO; Manufacturer PN: RC0603JR-070RL; Tolerance: 5%; RK PN: 901002435-1; Priority: A; Wattage: 1/10W; Optional: X; Value: NC/0R; Part Type: 通用厚膜电阻; Created by: YTL
R2220 = RESISTOR5: 通用厚膜电阻,100K,+/-5%,R0402,1/16W.; Part Reference: R2220; Manufacturer PN: RC0402JR-07100KL; Manufacturer: YAGEO; Tolerance: 5%; Wattage: 1/16W; Priority: A; RK PN: 901001447; PCB Footprint: R0402; Value: 100K; Created by: YTL; Part Type: 通用厚膜电阻
R2221 = RESISTOR5: 通用厚膜电阻,10K,+/-5%,R0402,1/16W.; Part Reference: R2221; Manufacturer: YAGEO; Manufacturer PN: RC0402JR-0710KL; Tolerance: 5%; RK PN: 901001449; Priority: A; Wattage: 1/16W; PCB Footprint: R0402; Value: 10K; Part Type: 通用厚膜电阻; Created by: YTL
R2222 = RESISTOR5: 通用厚膜电阻,0R,+/-5%,R0402,1/16W.; Part Reference: R2222; Manufacturer: YAGEO; Manufacturer PN: RC0402JR-070RL; Tolerance: 5%; RK PN: 901001446; Priority: A; Wattage: 1/16W; PCB Footprint: R0402; Value: 0R; Part Type: 通用厚膜电阻; Created by: YTL
R2223 = RESISTOR5_NC: 通用厚膜电阻,0R,+/-5%,R0402,1/16W.; Part Reference: R2223; Manufacturer PN: RC0402JR-070RL; Manufacturer: YAGEO; Tolerance: 5%; Optional: X; Wattage: 1/16W; Priority: A; RK PN: 901001446-1; PCB Footprint: R0402; Value: NC/0R; Created by: YTL; Part Type: 通用厚膜电阻
R2224 = RESISTOR5: 通用厚膜电阻,10K,+/-5%,R0402,1/16W.; Part Reference: R2224; Manufacturer: YAGEO; Manufacturer PN: RC0402JR-0710KL; Tolerance: 5%; RK PN: 901001449; Priority: A; Wattage: 1/16W; PCB Footprint: R0402; Value: 10K; Part Type: 通用厚膜电阻; Created by: YTL
R2225 = RESISTOR5: 通用厚膜电阻,0R,+/-5%,R0402,1/16W.; Part Reference: R2225; Manufacturer: YAGEO; Manufacturer PN: RC0402JR-070RL; Tolerance: 5%; RK PN: 901001446; Priority: A; Wattage: 1/16W; PCB Footprint: R0402; Value: 0R; Part Type: 通用厚膜电阻; Created by: YTL
R2226 = RESISTOR5: 通用厚膜电阻,51K,+/-5%,R0402,1/16W.; Part Reference: R2226; Manufacturer: YAGEO; Manufacturer PN: RC0402JR-0751KL; Tolerance: 5%; RK PN: 901001568; Priority: A; Wattage: 1/16W; PCB Footprint: R0402; Value: 51K; Part Type: 通用厚膜电阻; Created by: YTL
R2227 = RESISTOR1: 通用厚膜电阻,100K,+/-1%,R0402,1/16W.; Part Reference: R2227; Manufacturer PN: RC0402FR-07100KL; Manufacturer: YAGEO; Wattage: 1/16W; Priority: A; RK PN: 901000766; PCB Footprint: R0402; Value: 100K; Created by: YTL; Part Type: 通用厚膜电阻
R2228 = RESISTOR5: 通用厚膜电阻,10K,+/-5%,R0402,1/16W.; Part Reference: R2228; Manufacturer PN: RC0402JR-0710KL; Manufacturer: YAGEO; Tolerance: 5%; Wattage: 1/16W; Priority: A; RK PN: 901001449; PCB Footprint: R0402; Value: 10K; Created by: YTL; Part Type: 通用厚膜电阻
R2229 = RESISTOR5: 通用厚膜电阻,0R,+/-5%,R0402,1/16W.; Part Reference: R2229; Manufacturer: YAGEO; Manufacturer PN: RC0402JR-070RL; Tolerance: 5%; RK PN: 901001446; Priority: A; Wattage: 1/16W; PCB Footprint: R0402; Value: 0R; Part Type: 通用厚膜电阻; Created by: YTL
R2230 = RESISTOR1: 通用厚膜电阻,100K,+/-1%,R0402,1/16W.; Part Reference: R2230; Manufacturer PN: RC0402FR-07100KL; Manufacturer: YAGEO; Wattage: 1/16W; Priority: A; RK PN: 901000766; PCB Footprint: R0402; Value: 100K; Created by: YTL; Part Type: 通用厚膜电阻
R2231 = RESISTOR5: 通用厚膜电阻,0R,+/-5%,R0402,1/16W.; Part Reference: R2231; Manufacturer: YAGEO; Manufacturer PN: RC0402JR-070RL; Tolerance: 5%; RK PN: 901001446; Priority: A; Wattage: 1/16W; PCB Footprint: R0402; Value: 0R; Part Type: 通用厚膜电阻; Created by: YTL
R2233 = RESISTOR5: 通用厚膜电阻,0R,+/-5%,R0402,1/16W.; Part Reference: R2233; Manufacturer: YAGEO; Manufacturer PN: RC0402JR-070RL; Tolerance: 5%; RK PN: 901001446; Priority: A; Wattage: 1/16W; PCB Footprint: R0402; Value: 0R; Part Type: 通用厚膜电阻; Created by: YTL
R2234 = RESISTOR5: 通用厚膜电阻,0R,+/-5%,R0402,1/16W.; Part Reference: R2234; Manufacturer: YAGEO; Manufacturer PN: RC0402JR-070RL; Tolerance: 5%; RK PN: 901001446; Priority: A; Wattage: 1/16W; PCB Footprint: R0402; Value: 0R; Part Type: 通用厚膜电阻; Created by: YTL
R2235 = RESISTOR5: 通用厚膜电阻,10K,+/-5%,R0402,1/16W.; Part Reference: R2235; Manufacturer PN: RC0402JR-0710KL; Manufacturer: YAGEO; Tolerance: 5%; Wattage: 1/16W; Priority: A; RK PN: 901001449; PCB Footprint: R0402; Value: 10K; Created by: YTL; Part Type: 通用厚膜电阻
R2236 = RESISTOR5: 通用厚膜电阻,0R,+/-5%,R0402,1/16W.; Part Reference: R2236; Manufacturer: YAGEO; Manufacturer PN: RC0402JR-070RL; Tolerance: 5%; RK PN: 901001446; Priority: A; Wattage: 1/16W; PCB Footprint: R0402; Value: 0R; Part Type: 通用厚膜电阻; Created by: YTL
R2237 = RESISTOR5: 通用厚膜电阻,0R,+/-5%,R0402,1/16W.; Part Reference: R2237; Manufacturer: YAGEO; Manufacturer PN: RC0402JR-070RL; Tolerance: 5%; RK PN: 901001446; Priority: A; Wattage: 1/16W; PCB Footprint: R0402; Value: 0R; Part Type: 通用厚膜电阻; Created by: YTL
R2238 = RESISTOR5: 通用厚膜电阻,10K,+/-5%,R0402,1/16W.; Part Reference: R2238; Manufacturer: YAGEO; Manufacturer PN: RC0402JR-0710KL; Tolerance: 5%; RK PN: 901001449; Priority: A; Wattage: 1/16W; PCB Footprint: R0402; Value: 10K; Part Type: 通用厚膜电阻; Created by: YTL
R2239 = RESISTOR5: 通用厚膜电阻,10K,+/-5%,R0402,1/16W.; Part Reference: R2239; Manufacturer: YAGEO; Manufacturer PN: RC0402JR-0710KL; Tolerance: 5%; RK PN: 901001449; Priority: A; Wattage: 1/16W; PCB Footprint: R0402; Value: 10K; Part Type: 通用厚膜电阻; Created by: YTL
R2240 = RESISTOR5: 通用厚膜电阻,0R,+/-5%,R0402,1/16W.; Part Reference: R2240; Manufacturer: YAGEO; Manufacturer PN: RC0402JR-070RL; Tolerance: 5%; RK PN: 901001446; Priority: A; Wattage: 1/16W; PCB Footprint: R0402; Value: 0R; Part Type: 通用厚膜电阻; Created by: YTL
R2242 = RESISTOR5: 通用厚膜电阻,0R,+/-5%,R0402,1/16W.; Part Reference: R2242; Manufacturer: YAGEO; Manufacturer PN: RC0402JR-070RL; Tolerance: 5%; RK PN: 901001446; Priority: A; Wattage: 1/16W; PCB Footprint: R0402; Value: 0R; Part Type: 通用厚膜电阻; Created by: YTL
R2243 = RESISTOR5: 通用厚膜电阻,0R,+/-5%,R0402,1/16W.; Part Reference: R2243; Manufacturer: YAGEO; Manufacturer PN: RC0402JR-070RL; Tolerance: 5%; RK PN: 901001446; Priority: A; Wattage: 1/16W; PCB Footprint: R0402; Value: 0R; Part Type: 通用厚膜电阻; Created by: YTL
R2244 = RESISTOR5: 通用厚膜电阻,0R,+/-5%,R0402,1/16W.; Part Reference: R2244; Manufacturer: YAGEO; Manufacturer PN: RC0402JR-070RL; Tolerance: 5%; RK PN: 901001446; Priority: A; Wattage: 1/16W; PCB Footprint: R0402; Value: 0R; Part Type: 通用厚膜电阻; Created by: YTL
R2245 = RESISTOR5: 通用厚膜电阻,10K,+/-5%,R0402,1/16W.; Part Reference: R2245; Manufacturer PN: RC0402JR-0710KL; Manufacturer: YAGEO; Tolerance: 5%; Wattage: 1/16W; Priority: A; RK PN: 901001449; PCB Footprint: R0402; Value: 10K; Created by: YTL; Part Type: 通用厚膜电阻
R2246 = RESISTOR5: 通用厚膜电阻,0R,+/-5%,R0402,1/16W.; Part Reference: R2246; Manufacturer: YAGEO; Manufacturer PN: RC0402JR-070RL; Tolerance: 5%; RK PN: 901001446; Priority: A; Wattage: 1/16W; PCB Footprint: R0402; Value: 0R; Part Type: 通用厚膜电阻; Created by: YTL
R2247 = RESISTOR5: 通用厚膜电阻,0R,+/-5%,R0402,1/16W.; Part Reference: R2247; Manufacturer: YAGEO; Manufacturer PN: RC0402JR-070RL; Tolerance: 5%; RK PN: 901001446; Priority: A; Wattage: 1/16W; PCB Footprint: R0402; Value: 0R; Part Type: 通用厚膜电阻; Created by: YTL
R2250 = RESISTOR5: 通用厚膜电阻,0R,+/-5%,R0402,1/16W.; Part Reference: R2250; Manufacturer: YAGEO; Manufacturer PN: RC0402JR-070RL; Tolerance: 5%; RK PN: 901001446; Priority: A; Wattage: 1/16W; PCB Footprint: R0402; Value: 0R; Part Type: 通用厚膜电阻; Created by: YTL
U2200 = DCDC_ETA3409: 3A, 1MHz Synchronous Buck Converter with 7.3V OVP; Part Reference: U2200; Manufacturer: ETA(钰泰); Priority: A; RK PN: 906000413; PCB Footprint: SOT_23_5; Value: ETA3409; Created by: JJJ; Manufacturer PN: ETA3409; Part Type: DCDC
U2201 = DCDC_ETA3409: 3A, 1MHz Synchronous Buck Converter with 7.3V OVP; Part Reference: U2201; Manufacturer: ETA(钰泰); RK PN: 906000413; Priority: A; PCB Footprint: SOT_23_5; Value: ETA3409; Part Type: DCDC; Manufacturer PN: ETA3409; Created by: JJJ
U2202 = LDO_PT5108: 1.8V Output,300mA, Low Dropout, Low Noise Ultra-Fast Without Bypass Capacitor CMOS LDO Regulator; Part Reference: U2202; Manufacturer: Richtek（立錡）; Priority: A; PCB Footprint: SOT_23_5; Value: RT9193-18GB; RK PN: RT9193-18GB; Part Type: LDO; Manufacturer PN: RT9193-18GB; Created by: JJJ
U2203 = RTC_HYM8563: I2C Real Time Clock/Calendar; Part Reference: U2203; Manufacturer: Haoyu（昊昱微电子）; Priority: A; PCB Footprint: TSSOP8_3R10X3R10X1R10; Value: HYM8563TS; Created by: JJJ; Manufacturer PN: HYM8563TS; Part Type: RTC; RK PN: HYM8563TS
U2204 = LDO_PT5108: 2.8V Output,300mA, Low Dropout, Low Noise Ultra-Fast Without Bypass Capacitor CMOS LDO Regulator; Part Reference: U2204; Manufacturer: Richtek（立錡）; Priority: A; PCB Footprint: SOT_23_5; Value: RT9193-28GB; RK PN: RT9193-28GB; Part Type: LDO; Manufacturer PN: RT9193-28GB; Created by: JJJ
Y2200 = CRYSTAL_2P: 无源晶振，32.768KHz,±20ppm，12.5pF; Part Reference: Y2200; Manufacturer: TKD(泰晶); RK PN: SF-3215; Priority: A; PCB Footprint: CRY2_3R20x1R50x0R90; Value: 32.768KHz; Part Type: CRYSTAL; Manufacturer PN: SF-3215; Created by: YWQ